# Altium schematic sheet esc.SchDoc: Fault-Tolerant Quadcopter
size A; DrawnBy: Vaughn Kottler; Engineer: Vaughn Kottler; Revision: A
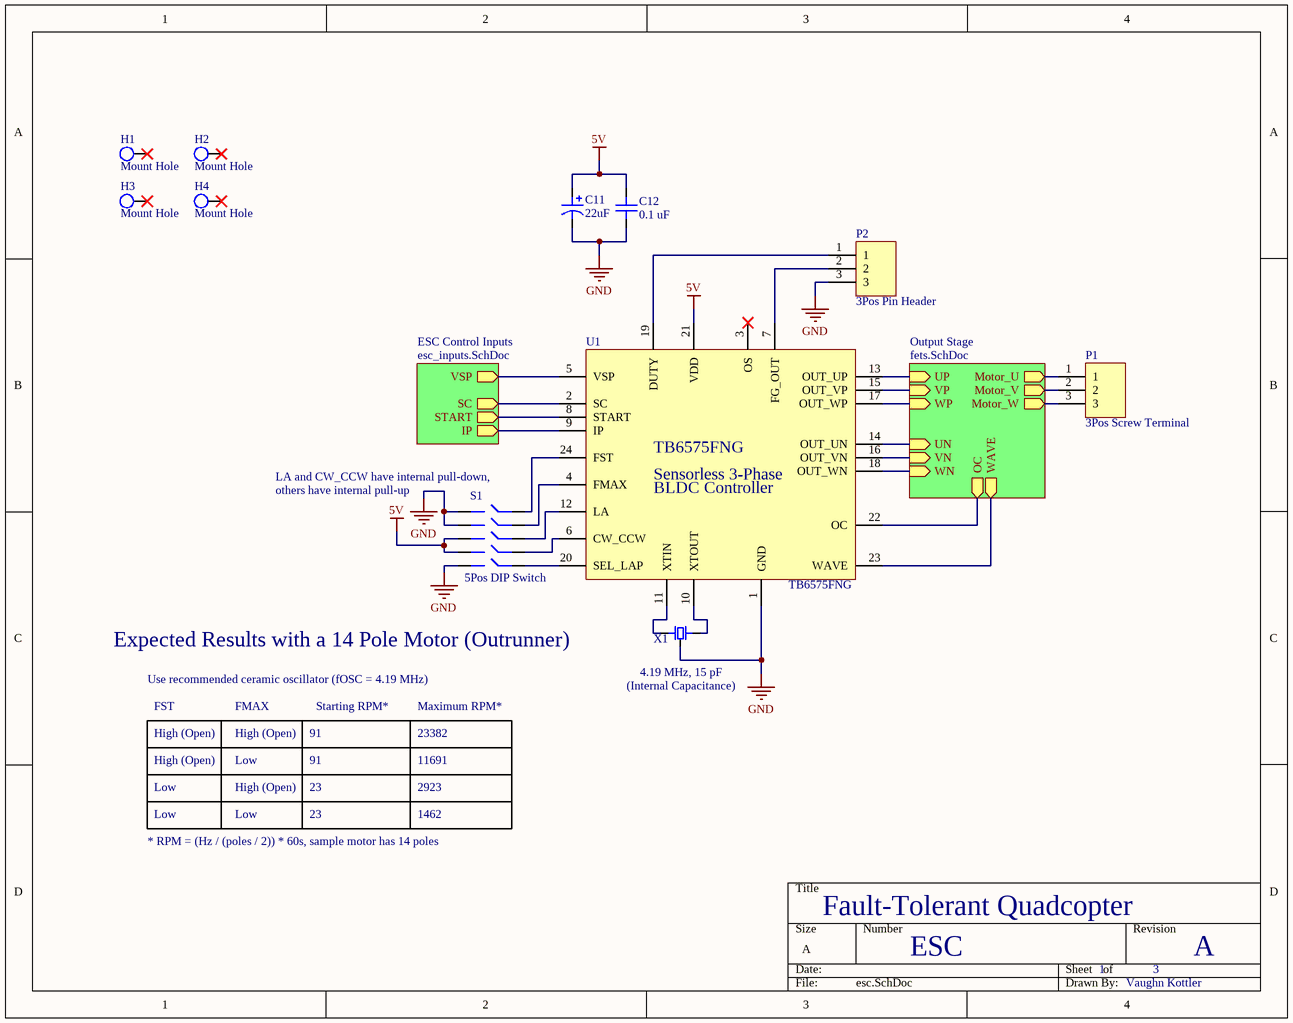
[diagram p0: esc.SchDoc]

## Parts
C11  22uF  [CAP-CAN-5.3x5.3]
C12  0.1 uF  [CAP-CER-0805-SHORT]
H1  Mount Hole  [m2 Mount Hole]
H2  Mount Hole  [m2 Mount Hole]
H3  Mount Hole  [m2 Mount Hole]
H4  Mount Hole  [m2 Mount Hole]
P1  3Pos Screw Terminal  [3Pos Screw Terminal]
P2  3Pos Pin Header  [3Pos Pin Header F RA R]
S1  5Pos DIP Switch  [DIP-SW-5]
U1  TB6575FNG  [SSOP24-0.65]
X1  4.19 MHz, 15 pF  [CSTCR]

## Sub-sheets
ESC Control Inputs = esc_inputs.SchDoc: IP (out), START (out), SC (out), VSP (out)
Output Stage = fets.SchDoc: UN (in), WN (in), VN (in), Motor_W (out), Motor_U (out), WAVE (out), OC (out), Motor_V (out), WP (in), UP (in), VP (in)

## Nets
5V: C11.1 C12.2 S1.3 S1.4 U1.21(VDD)
GND: C11.2 C12.1 P2.3 S1.1 S1.2 S1.5 U1.1(GND) X1.2(GND)
NetP1_1: P1.1 ; sheet Output Stage/Motor_U
NetP1_2: P1.2 ; sheet Output Stage/Motor_V
NetP1_3: P1.3 ; sheet Output Stage/Motor_W
NetP2_1: P2.1 U1.19(DUTY)
NetP2_2: P2.2 U1.7(FG_OUT)
NetS1_6: S1.6 U1.20(SEL_LAP)
NetS1_7: S1.7 U1.6(CW_CCW)
NetS1_8: S1.8 U1.12(LA)
NetS1_9: S1.9 U1.4(FMAX)
NetS1_10: S1.10 U1.24(FST)
NetU1_2: U1.2(SC) ; sheet ESC Control Inputs/SC
NetU1_5: U1.5(VSP) ; sheet ESC Control Inputs/VSP
NetU1_8: U1.8(START) ; sheet ESC Control Inputs/START
NetU1_9: U1.9(IP) ; sheet ESC Control Inputs/IP
NetU1_10: U1.10(XTOUT) X1.3(OUT)
NetU1_11: U1.11(XTIN) X1.1(IN)
NetU1_13: U1.13(OUT_UP) ; sheet Output Stage/UP
NetU1_14: U1.14(OUT_UN) ; sheet Output Stage/UN
NetU1_15: U1.15(OUT_VP) ; sheet Output Stage/VP
NetU1_16: U1.16(OUT_VN) ; sheet Output Stage/VN
NetU1_17: U1.17(OUT_WP) ; sheet Output Stage/WP
NetU1_18: U1.18(OUT_WN) ; sheet Output Stage/WN
NetU1_22: U1.22(OC) ; sheet Output Stage/OC
NetU1_23: U1.23(WAVE) ; sheet Output Stage/WAVE

Not connected (* = marked no-connect by the designer): H1 H*; H2 H*; H3 H*; H4 H*; U1 3(OS)*

## Notes on the sheet
- (near S1) LA and CW_CCW have internal pull-down,
- (near S1) others have internal pull-up
- (near X1) Expected Results with a 14 Pole Motor (Outrunner)
- Use recommended ceramic oscillator (fOSC = 4.19 MHz)
- (near X1) (Internal Capacitance)
- FST
- High (Open)
- FMAX
- Low
- 91
- Starting RPM*
- Maximum RPM*
- 11691
- 23382
- 23
- 1462
- 2923
- * RPM = (Hz / (poles / 2)) * 60s, sample motor has 14 poles
- ESC
- 1
- 3
- (in symbol TB6575FNG) Sensorless 3-Phase; BLDC Controller

## Library data of the parts
C11 = CAP-CAN-22uF-35V: ±20%, 5.3mm x 5.3mm; Supplier 1: Digi-Key; Supplier Part Number 1: PCE3838DKR-ND
C12 = CAP-CER-0.1uF-25V: 10%, 0805; ComponentLink1Description: Capacitor Book (Amazon); ComponentLink1URL: https://www.amazon.com/gp/product/B0728HBDRW/
P1 = 3Pos Screw Terminal: 0.2" Pitch 1x3
P2 = 3Pos Pin Header: 0.1" Pitch 1x3
S1 = 5Pos DIP Switch: 5 Position 0.1" SMT Dip Switch; Supplier 1: Digi-Key; Supplier Part Number 1: CT2195LPST-ND
U1 = TB6575FNG: Sensorless 3-Phase BLDC Controller; Supplier 1: Digi-Key; Supplier Part Number 1: TB6575FNGC8ELDKR-ND; ComponentLink1Description: Datasheet; ComponentLink1URL: toshiba.semicon-storage.com/info/docget.jsp?did=2162&prodName=TB6575FNG
X1 = XTAL-4.19MHz-15pF: Ceramic, 3-SMD, Built-In Capacitance; Supplier 1: Digi-Key; ComponentLink1Description: Part Numbering; ComponentLink1URL: https://www.murata.com/en-us/products/productdata/8796821913630/L0430E.pdf; ComponentLink2Description: Application Note; ComponentLink2URL: https://www.murata.com/~/media/webrenewal/support/library/catalog/products/timingdevice/ceralock/p17e.ashx; ComponentLink3Description: Datasheet; ComponentLink3URL: https://www.murata.com/~/media/webrenewal/support/library/catalog/products/timingdevice/ceralock/p16e.ashx; Supplier Part Number 1: 490-1201-6-ND